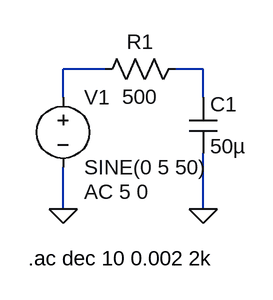
[diagram p0: schematic low pass filter.asc]
low pass filter.asc, the LTspice schematic file:
Version 4.1
SHEET 1 880 680
WIRE 128 96 80 96
WIRE 240 96 208 96
WIRE 80 128 80 96
WIRE 240 128 240 96
WIRE 80 256 80 208
WIRE 240 256 240 192
FLAG 80 256 0
FLAG 240 256 0
SYMBOL res 224 80 R90
WINDOW 0 0 56 VBottom 2
WINDOW 3 32 56 VTop 2
SYMATTR InstName R1
SYMATTR Value 500
SYMBOL cap 224 128 R0
SYMATTR InstName C1
SYMATTR Value 50µ
SYMBOL voltage 80 112 R0
WINDOW 123 24 124 Left 2
WINDOW 39 0 0 Left 0
SYMATTR InstName V1
SYMATTR Value SINE(0 5 50)
SYMATTR Value2 AC 5 0
TEXT 40 312 Left 2 !.ac dec 10 0.002 2k

The netlist it stands for:
* low pass filter.asc
R1 N002 N001 500
C1 N002 0 50µ
V1 N001 0 SINE(0 5 50) AC 5 0
.ac dec 10 0.002 2k
.backanno
.end